# Altium project AW_SHIELD.PrjPcb
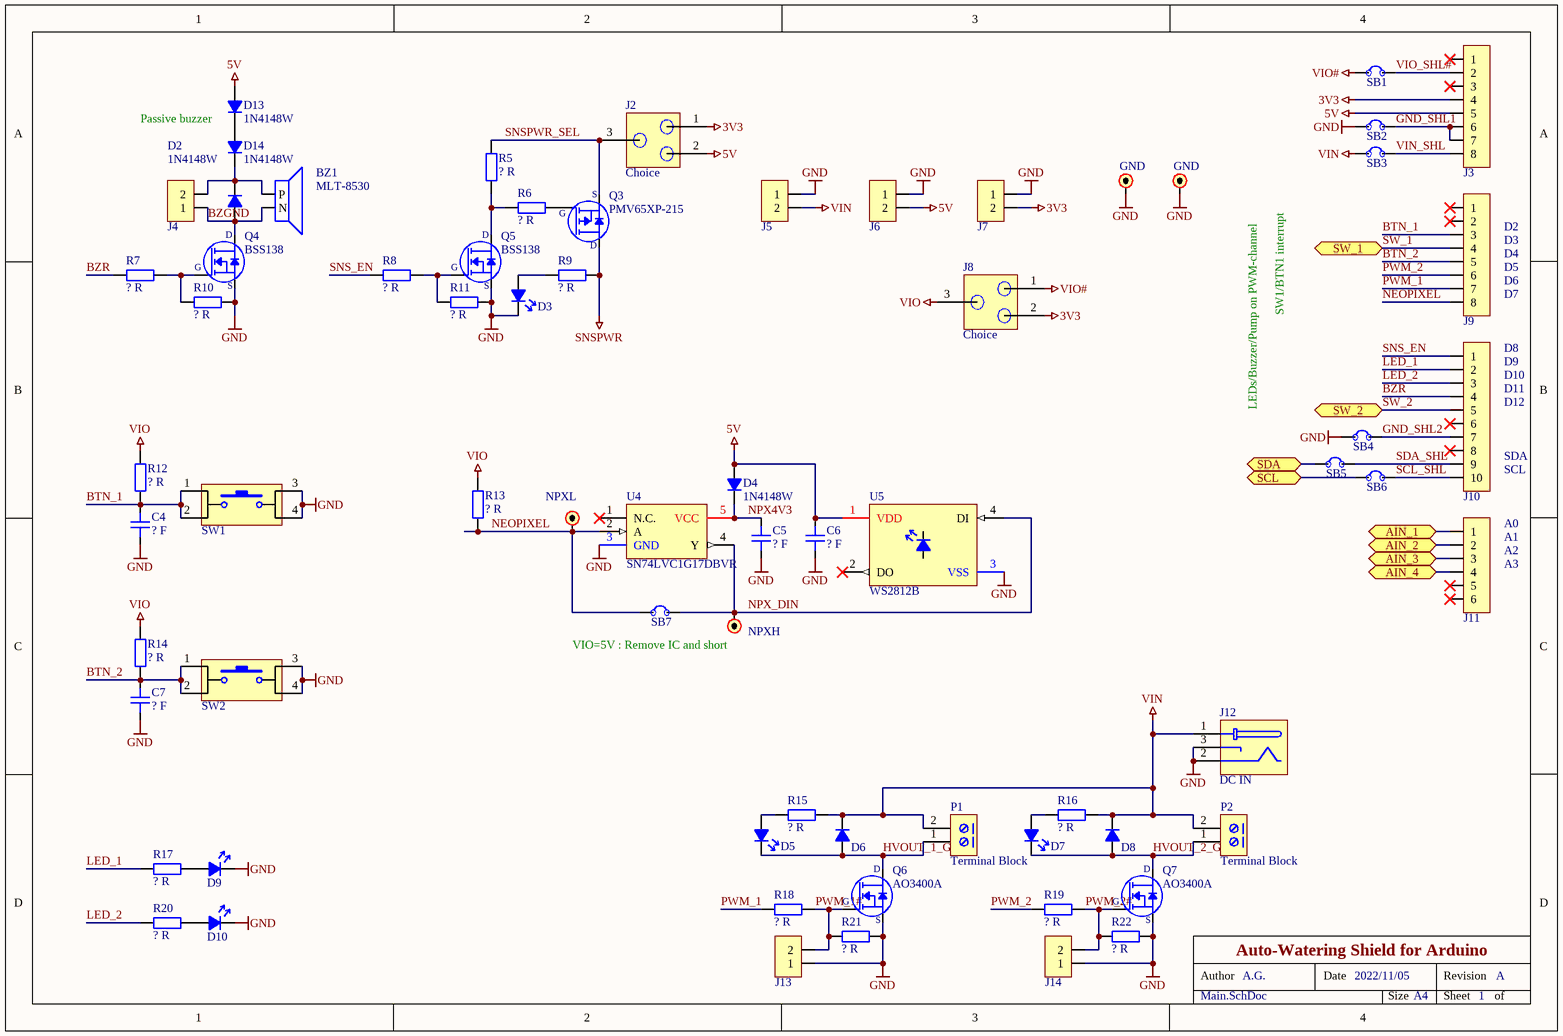
[diagram p0: Main.SchDoc]
Date: 2022/11/05; DrawnBy: A.G.; Revision: A; Title: Auto-Watering Shield for Arduino
3 sheets, 125 parts. Net scope: flat (ports and power ports of the same name join across sheets).
Board file: AW_SHIELD.PcbDoc
Sheets:
  Main.SchDoc
  I2C.SchDoc
  Inputs.SchDoc

## Sheet Main.SchDoc: Auto-Watering Shield for Arduino
size A4; Date: 2022/11/05; DrawnBy: A.G.; DocumentNumber: 1; Revision: A; SheetNumber: 1; ProjectName: AW_SHIELD.PrjPcb

### Parts
BZ1  MLT-8530  [MLT-8530]
C4  ? F  [0603C_RF_M]
C5  ? F  [0603C_RF_M]
C6  ? F  [0603C_RF_M]
C7  ? F  [0603C_RF_M]
D2  1N4148W  [D_SOD-123]
D3  Unspecified  [0805LED_RF_M]  (value not drawn)
D4  1N4148W  [D_SOD-123]
D5  Unspecified  [0805LED_RF_M]  (value not drawn)
D6  D  [ONSEMI_DO214AC_RF_M]  (value not drawn)
D7  Unspecified  [0805LED_RF_M]  (value not drawn)
D8  D  [ONSEMI_DO214AC_RF_M]  (value not drawn)
D9  Unspecified  [0805LED_RF_M]  (value not drawn)
D10  Unspecified  [0805LED_RF_M]  (value not drawn)
D13  1N4148W  [D_SOD-123]
D14  1N4148W  [D_SOD-123]
J2  Choice  [CHOICE_R0805_TR]
J3  PINHDR-8P1  [PINHDR-8P1-2.54]  (value not drawn)
J4  PINHDR-2P1  [HEADER-2.54-2P1]  (value not drawn)
J5  PINHDR-2P1  [HEADER-2.54-2P1]  (value not drawn)
J6  PINHDR-2P1  [HEADER-2.54-2P1]  (value not drawn)
J7  PINHDR-2P1  [HEADER-2.54-2P1]  (value not drawn)
J8  Choice  [CHOICE_R0805_TR]
J9  PINHDR-8P1  [PINHDR-8P1-2.54]  (value not drawn)
J10  PINHDR-10P1  [HEADER-2.54-10P1]  (value not drawn)
J11  PINHDR-6P1  [HEADER-2.54-6P1]  (value not drawn)
J12  DC IN  [CON JACK PWR 2.5mm PJ-002BH - duplicate]
J13  PINHDR-2P1  [HEADER-2.54-2P1]  (value not drawn)
J14  PINHDR-2P1  [HEADER-2.54-2P1]  (value not drawn)
P1  Terminal Block  [KF128-2P]
P2  Terminal Block  [KF128-2P]
Q3  PMV65XP-215  [IRLML_SOT-23]
Q4  BSS138  [IRLML_SOT-23]
Q5  BSS138  [IRLML_SOT-23]
Q6  AO3400A  [IRLML_SOT-23]
Q7  AO3400A  [IRLML_SOT-23]
R5  ? R  [R0603_RF_M]
R6  ? R  [R0603_RF_M]
R7  ? R  [R0603_RF_M]
R8  ? R  [R0603_RF_M]
R9  ? R  [R0603_RF_M]
R10  ? R  [R0603_RF_M]
R11  ? R  [R0603_RF_M]
R12  ? R  [R0603_RF_M]
R13  ? R  [R0603_RF_M]
R14  ? R  [R0603_RF_M]
R15  ? R  [R0603_RF_M]
R16  ? R  [R0603_RF_M]
R17  ? R  [R0603_RF_M]
R18  ? R  [R0603_RF_M]
R19  ? R  [R0603_RF_M]
R20  ? R  [R0603_RF_M]
R21  ? R  [R0603_RF_M]
R22  ? R  [R0603_RF_M]
SB1  Solder Bridge  [SLDR_BRDG_0603_OPEN]  (value not drawn)
SB2  Solder Bridge  [SLDR_BRDG_0603_OPEN]  (value not drawn)
SB3  Solder Bridge  [SLDR_BRDG_0603_OPEN]  (value not drawn)
SB4  Solder Bridge  [SLDR_BRDG_0603_OPEN]  (value not drawn)
SB5  Solder Bridge  [SLDR_BRDG_0603_OPEN]  (value not drawn)
SB6  Solder Bridge  [SLDR_BRDG_0603_OPEN]  (value not drawn)
SB7  Solder Bridge  [SLDR_BRDG_0603_OPEN]  (value not drawn)
SW1  BTN-SPST-NO-4C  [SW_TL3305AF160QG]  (value not drawn)
SW2  BTN-SPST-NO-4C  [SW_TL3305AF160QG]  (value not drawn)
TP5  GND  [PAD_R_1.5MM]
TP6  GND  [PAD_R_1.5MM]
TP7  NPXL  [PAD_R_1MM]
TP8  NPXH  [PAD_R_1MM]
U4  SN74LVC1G17DBVR  [TI_SOT-23-5]
U5  WS2812B  [WS2812B]

### Ports
AIN_1, AIN_2, AIN_3, AIN_4, SCL, SDA, SW_1, SW_2

### Nets
3V3: J2.1 J3.4 J7.2 J8.2
5V: C6.1 D4.A D13.A J2.2 J3.5 J6.2 U5.1(VDD)
GND: C4.1 C5.2 C6.2 C7.1 D3.C D9.C D10.C J5.1 J6.1 J7.1 J12.2 J12.3 J13.1 J14.1 Q4.2(S) Q5.2(S) Q6.2(S) Q7.2(S) R10.1 R11.1 R21.1 R22.1 SB2.1 SB4.1 SW1.3 SW1.4 SW2.3 SW2.4 TP5.1 TP6.1 U4.3(GND) U5.3(VSS)
SNSPWR: Q3.3(Drain) R9.2
VIN: D6.C D8.C J5.2 J12.1 P1.2 P2.2 R15.2 R16.2 SB3.1
VIO: J8.3 R12.2 R13.1 R14.2
VIO#: J8.1 SB1.1
AIN_1: J11.1 ; port AIN_1
AIN_2: J11.2 ; port AIN_2
AIN_3: J11.3 ; port AIN_3
AIN_4: J11.4 ; port AIN_4
BTN_1: C4.2 J9.3 R12.1 SW1.1 SW1.2
BTN_2: C7.2 J9.5 R14.1 SW2.1 SW2.2
BZGND: BZ1.N D2.A J4.1 Q4.3(D)
BZR: J10.4 R7.1
GND_SHL1: J3.6 J3.7 SB2.2
GND_SHL2: J10.7 SB4.2
HVOUT_1_GND: D5.C D6.A P1.1 Q6.3(D)
HVOUT_2_GND: D7.C D8.A P2.1 Q7.3(D)
LED_1: J10.2 R17.1
LED_2: J10.3 R20.1
NEOPIXEL: J9.8 R13.2 SB7.1 TP7.1 U4.2(A)
NPX4V3: C5.1 D4.C U4.5(VCC)
NPX_DIN: SB7.2 TP8.1 U4.4(Y) U5.4(DI)
PWM_1: J9.7 R18.1
PWM_1#: J13.2 Q6.1(G) R18.2 R21.2
PWM_2: J9.6 R19.1
PWM_2#: J14.2 Q7.1(G) R19.2 R22.2
SCL: SB6.1 ; port SCL
SCL_SHL: J10.10 SB6.2
SDA: SB5.1 ; port SDA
SDA_SHL: J10.9 SB5.2
SNS_EN: J10.1 R8.1
SNSPWR_SEL: J2.3 Q3.2(Source) R5.1
SW_1: J9.4 ; port SW_1
SW_2: J10.5 ; port SW_2
VIN_SHL: J3.8 SB3.2
VIO_SHL#: J3.2 SB1.2
NetBZ1_P: BZ1.P D2.C D14.C J4.2
NetD3_A: D3.A R9.1
NetD5_A: D5.A R15.1
NetD7_A: D7.A R16.1
NetD9_A: D9.A R17.2
NetD10_A: D10.A R20.2
NetD13_C: D13.C D14.A
NetQ3_1: Q3.1(Gate) R6.2
NetQ4_1: Q4.1(G) R7.2 R10.2
NetQ5_1: Q5.1(G) R8.2 R11.2
NetQ5_3: Q5.3(D) R5.2 R6.1

Not connected (* = marked no-connect by the designer): J3 1* 3*; J9 1* 2*; J10 6* 8*; J11 5* 6*; U4 1(N.C.)*; U5 2(DO)*

### Notes on the sheet
- Passive buzzer
- (near J9) D2
- (near J9) D3
- SW1/BTN1 interrupt
- (near J9) D4
- (near J9) D5
- (near J9) D6
- (near J9) D7
- D8
- (near J10) D9
- (near J10) D10
- LEDs/Buzzer/Pump on PWM-channel
- (near J10) D11
- (near J10) D12
- (near J10) SDA
- (near J10) SCL
- A0
- (near J11) A1
- (near J11) A2
- (near J11) A3
- (near TP8) VIO=5V : Remove IC and short
- Author
- Date
- Revision
- Size
- A4
- Sheet
- of
- (in symbol PMV65XP-215) S; G; D

### Library data of the parts
BZ1 = MLT-8530: Magnetic Buzzer SMD 8.5x3.3 Passive 2.5V~4.5V; Manufacturer: Jiangsu Huaneng Elec; Rated Voltage: 3.6 V; Resonant Frequency: 2700 Hz; Supplier Link: https://www.lcsc.com/mobile/product-detail/Buzzers_Jiangsu-Huaneng-Elec-MLT-8530_C94599.html; Supplier: LCSC; Alternative Supplier Link: https://www.aliexpress.ru/item/1005003620291811.html; Mounting Technology: SMT; Category: Buzzer
C4-C7 = C: Capacitor; Manufacturer: Generic Brand; Max Voltage: ? V; Value: ? F; Tolerance: ?; Mounting Technology: SMT; Tag: *; Manufacturer Part No: *; Supplier: *; Supplier Link: http://; Supplier Part No: *; Category: Capacitor
D2 D4 D13 D14 = 1N4148W: DIODE GEN PURP 100V 300MA SOD123; Similar Part: BAV16W; Manufacturer: Diodes Incorporated; Manufacturer Product Number: 1N4148W-7-F; Supplier Part No: 1N4148W-FDICT-ND; Supplier URL: https://www.digikey.com/en/products/detail/diodes-incorporated/1N4148W-7-F/814371; Mounting Technology: SMT; Package: SOD-123
D3 D5 D7 D9 D10 = LED: Manufacturer: Generic Brand; Forward Voltage Drop: ? V; Emitting Color: Unspecified; Manufacturer Part No: *; Supplier: *; Supplier Link: http://; Supplier Part No: *; Category: Diode; Mounting Technology: SMT
D6 D8 = D: Diode (Rectifier); Manufacturer: Generic Brand; Max Forward Voltage: ? V; Power Rating: ? W; Manufacturer Part No: *; Supplier: *; Supplier Link: http://; Supplier Part No: *; Mounting Technology: SMT; Category: Diode
J3 J9 = PINHDR-8P1: Pin Header Single Row 8 Positions; Mounting Technology: THT
J4-J7 J13 J14 = PINHDR-2P1: Pin Header Single Row 2 Positions; Mounting Technology: THT
J10 = PINHDR-10P1: Generic Pin Header 10x1
J11 = PINHDR-6P1: Pin Header Single Row 6 Positions; Mounting Technology: THT
J12 = PJ-002BH: CONN PWR JACK 2.5X5.5MM SOLDER; Manufacturer: CUI Devices; PartNo: CP-002BH-ND; Supplier: DigiKey; ProductNumber: PJ-002BH; URL: https://www.digikey.com/en/products/detail/cui-devices/PJ-002BH/408447; UnitPrice: $0.74; MountType: THT
P1 P2 = TERM-BLOCK-2C
Q3 = PMV65XP-215: MOSFET P-CH 20V 2.8A 23SOT; Gate-Source Threshold Voltage: -0.69V (typ.); Drain-Source Breakdown Voltage: -20V; Drain Current: -2.8A (max.); Max Gate-Source Voltage: 12V (abs.); Supplier Part No: 1727-3124-1-ND; Supplier: DigiKey; Supplier Link: https://www.digikey.com/en/products/detail/nexperia-usa-inc/PMV65XP-215/949643; Mounting Technology: SMT; Package: SOT-23; Alternative Supplier: Chipdip; Alternative Supplier Link: https://www.chipdip.by/product/pmv65xp.215; Alternative Supplier Part No: 9000037397
Q4 Q5 = BSS138: MOSFET N-CH 50V 200MA SOT23; Manufacturer: ON Semiconductor; Manufacturer Part No: BSS138LT1G; Supplier: DigiKey; Supplier Link: https://www.digikey.com/en/products/detail/on-semiconductor/BSS138L/5044751; Supplier Part No: BSS138LCT-ND; Mounting Technology: SMT; Package: SOT-23; Alternative Supplier: Chipdip; Alternative Supplier Part No: 457167271; Alternative Supplier Link: https://www.chipdip.by/product/bss138-onsemi
Q6 Q7 = AO3400A: MOSFET N-CH 30V 5.7A SOT23-3L; Manufacturer: Alpha & Omega; Manufacturer Part No: AO3400A; Supplier: AliExpress; Supplier Link: https://aliexpress.ru/item/1626916488.html; Supplier Part No: 1626916488; Mounting Technology: SMT; Package: SOT-23-3L
R5-R22 = R: Resistor; Manufacturer: Generic Brand; Power Rating: ? W; Max Voltage: ? V; Value: ? R; Tolerance: ?; Supplier Link: http://; Category: Resistor; Mounting Technology: SMT
SW1 SW2 = BTN-SPST-NO-4C: Tactile Switch SPST-NO; Manufacturer: Generic Brand; Category: Tactile Button; Mounting Technology: THT; Supplier Link: http://
TP5-TP8 = Test Point: Test Point / Pad
U4 = SN74LVC1G17DBVR: IC BUF NON-INVERT 5.5V SOT23-5; Manufacturer: Texas Instruments; Supplier Part No: 296-11933-1-ND; Supplier URL: https://www.digikey.com/en/products/detail/texas-instruments/SN74LVC1G17DBVR/389051; Supplier Unit Price: $0.29; Supplier Packaging: Cut Tape; Manufacturer Product Number: SN74LVC1G17DBVR; Operating Temperature: -40°C ~ 125°C (TA); Mounting Type: SMT; Package: SOT-23-5
U5 = WS2812B: ADDRESS LED DISCRETE SERIAL RGB; Manufacturer: Worldsemi

## Sheet I2C.SchDoc: Auto-Watering Shield for Arduino
size A4; Date: 2022/11/05; DrawnBy: A.G.; DocumentNumber: 1; Revision: A; SheetNumber: 1; ProjectName: AW_SHIELD.PrjPcb
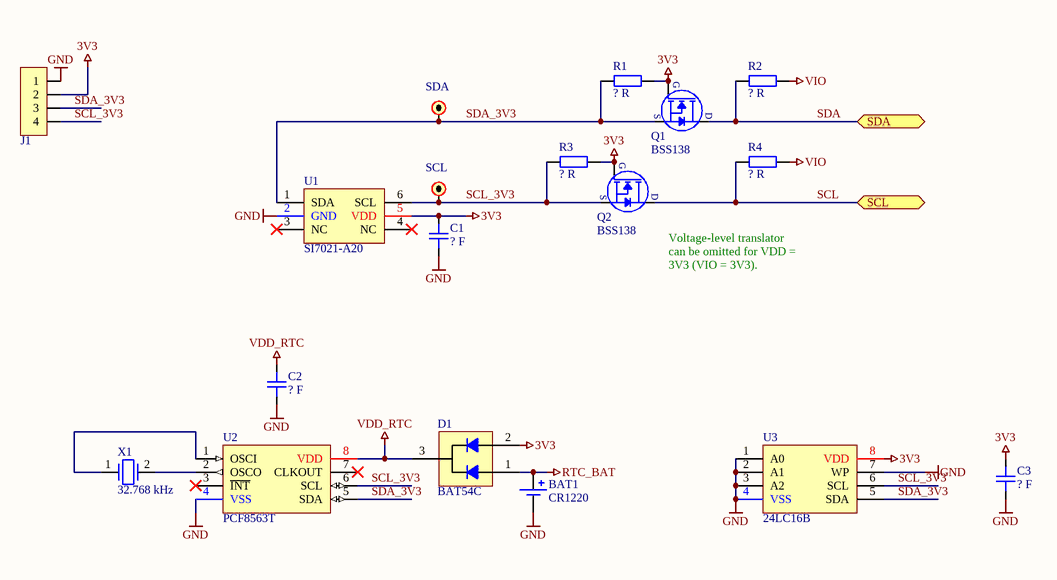
[diagram p1: I2C.SchDoc]

### Parts
BAT1  CR1220  [BC501SM]
C1  ? F  [0603C_RF_M]
C2  ? F  [0603C_RF_M]
C3  ? F  [0603C_RF_M]
D1  BAT54C  [IRLML_SOT-23]
J1  PINHDR-4P1  [HEADER-2.54-4P1]  (value not drawn)
Q1  BSS138  [IRLML_SOT-23]
Q2  BSS138  [IRLML_SOT-23]
R1  ? R  [R0603_RF_M]
R2  ? R  [R0603_RF_M]
R3  ? R  [R0603_RF_M]
R4  ? R  [R0603_RF_M]
TP1  SDA  [PAD_R_1MM]
TP2  SCL  [PAD_R_1MM]
U1  SI7021-A20  [SI7021_DFN-6_RF_M]
U2  PCF8563T  [SOIC-8]
U3  24LC16B  [SOIC-8]
X1  32.768 kHz  [XTAL_3215]

### Ports
SCL, SDA

### Nets
3V3: C1.2 C3.2 D1.2(A2) J1.2 Q1.1(G) Q2.1(G) R1.1 R3.1 U1.5(VDD) U3.8(VDD)
GND: BAT1.N C1.1 C2.1 C3.1 J1.1 U1.2(GND) U2.4(VSS) U3.1(A0) U3.2(A1) U3.3(A2) U3.4(VSS) U3.7(WP)
RTC_BAT: BAT1.P D1.1(A1)
VDD_RTC: C2.2 D1.3(C) U2.8(VDD)
VIO: R2.2 R4.1
SCL: Q2.3(D) R4.2 ; port SCL
SCL_3V3: J1.4 Q2.2(S) R3.2 TP2.1 U1.6(SCL) U2.6(SCL) U3.6(SCL)
SDA: Q1.3(D) R2.1 ; port SDA
SDA_3V3: J1.3 Q1.2(S) R1.2 TP1.1 U1.1(SDA) U2.5(SDA) U3.5(SDA)
NetU2_1: U2.1(OSCI) X1.1
NetU2_2: U2.2(OSCO) X1.2

Not connected (* = marked no-connect by the designer): U1 3(NC)* 4(NC)*; U2 3(~{INT})* 7(CLKOUT)*

### Notes on the sheet
- (near Q2) Voltage-level translator can be omitted for VDD = 3V3 (VIO = 3V3).
- Author
- Date
- Revision
- Size
- A4
- Sheet
- of

### Library data of the parts
BAT1 = BC501SM: Single Cell Battery; Nominal Voltage: 3V; Supplier: DigiKey; Supplier Part No: BC501SM-ND; Supplier Link: https://www.digikey.com/en/products/detail/mpd-memory-protection-devices/BC501SM/2439260; Mounting Technology: SMT; Suitable Battery: CR1220
C1-C3 = C: as C4 on sheet Main; Value: ? F; Tolerance: ?; Mounting Technology: SMT; Tag: *; Manufacturer Part No: *; Supplier: *; Supplier Link: http://; Supplier Part No: *; Category: Capacitor
D1 = BAT54C: DIODE ARRAY SCHOTTKY COMM CATH 30V 0.2A SOT-23; PartNo: BAT54C-FDICT-ND; Manufacturer: Diodes Incorporated; DiodeConfiguration: 1 Pair Common Cathode; ProductNumber: BAT54C-7-F; BaseProduct: BAT54C; Supplier: DigiKey; URL: https://www.digikey.com/en/products/detail/diodes-incorporated/BAT54C-7-F/717701; MountingTechnology: SMT; UnitPrice: $0.18; Package: SOT-23-3
J1 = PINHDR-4P1: Generic Pin Header 4x1
Q1 Q2 = BSS138: as Q4 on sheet Main; Supplier: DigiKey; Supplier Link: https://www.digikey.com/en/products/detail/on-semiconductor/BSS138L/5044751; Supplier Part No: BSS138LCT-ND; Mounting Technology: SMT; Package: SOT-23; Alternative Supplier: Chipdip; Alternative Supplier Part No: 457167271; Alternative Supplier Link: https://www.chipdip.by/product/bss138-onsemi
R1-R4 = R: as R5 on sheet Main; Value: ? R; Tolerance: ?; Supplier Link: http://; Category: Resistor; Mounting Technology: SMT
TP1 TP2 = Test Point: Test Point / Pad
U1 = SI7021-A20: SENS HUMID/TEMP 3.6V I2C 2% 6DFN; Manufacturer Product Number: SI7021-A20-GM1R; Manufacturer: Silicon Labs; Supplier URL: https://www.digikey.com/en/products/detail/silicon-labs/SI7021-A20-GM1/5048934; Supplier Part No: 336-4380-1-ND; Supplier Package: Cut Tape (CT); Mounting Type: SMT; Package: DFN-6
X1 = KX-327NHT: Crystal Resonator (2 Leads); Manufacturer: Geyer; Load Capacitance: 12.5 pF; Tolerance: 20 ppm; Manufacturer Part No: KX-327NHT; Mounting Technology: SMT; Alternative Supplier: Belchip; Alternative Supplier Link: https://belchip.by/product/?selected_product=33387; Alternative Supplier Part No: 33387; Category: Crystal; Value: 32.768 kHz

## Sheet Inputs.SchDoc: Auto-Watering Shield for Arduino
size A4; Date: 2022/11/05; DrawnBy: A.G.; DocumentNumber: 1; Revision: A; SheetNumber: 1; ProjectName: AW_SHIELD.PrjPcb
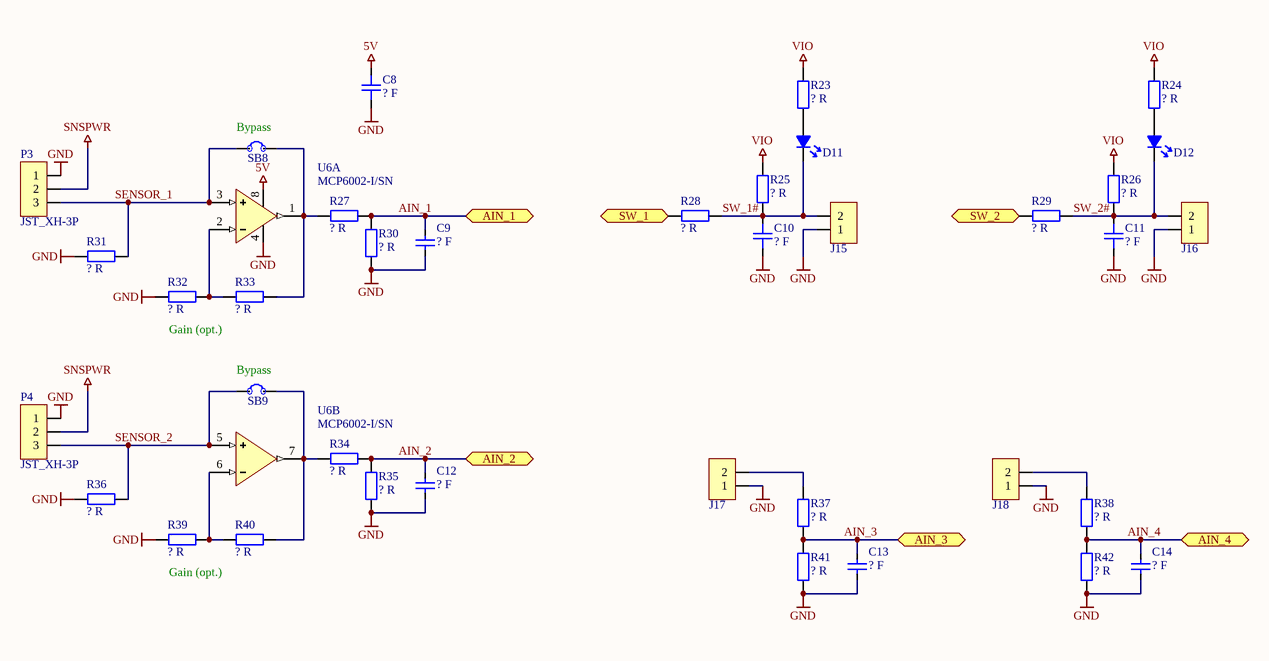
[diagram p2: Inputs.SchDoc]

### Parts
C8  ? F  [0603C_RF_M]
C9  ? F  [0603C_RF_M]
C10  ? F  [0603C_RF_M]
C11  ? F  [0603C_RF_M]
C12  ? F  [0603C_RF_M]
C13  ? F  [0603C_RF_M]
C14  ? F  [0603C_RF_M]
D11  Unspecified  [0805LED_RF_M]  (value not drawn)
D12  Unspecified  [0805LED_RF_M]  (value not drawn)
J15  PINHDR-2P1  [HEADER-2.54-2P1]  (value not drawn)
J16  PINHDR-2P1  [HEADER-2.54-2P1]  (value not drawn)
J17  PINHDR-2P1  [HEADER-2.54-2P1]  (value not drawn)
J18  PINHDR-2P1  [HEADER-2.54-2P1]  (value not drawn)
P3  JST_XH-3P  [JST_B3B-XH-A_LF_SN]
P4  JST_XH-3P  [JST_B3B-XH-A_LF_SN]
R23  ? R  [R0603_RF_M]
R24  ? R  [R0603_RF_M]
R25  ? R  [R0603_RF_M]
R26  ? R  [R0603_RF_M]
R27  ? R  [R0603_RF_M]
R28  ? R  [R0603_RF_M]
R29  ? R  [R0603_RF_M]
R30  ? R  [R0603_RF_M]
R31  ? R  [R0603_RF_M]
R32  ? R  [R0603_RF_M]
R33  ? R  [R0603_RF_M]
R34  ? R  [R0603_RF_M]
R35  ? R  [R0603_RF_M]
R36  ? R  [R0603_RF_M]
R37  ? R  [R0603_RF_M]
R38  ? R  [R0603_RF_M]
R39  ? R  [R0603_RF_M]
R40  ? R  [R0603_RF_M]
R41  ? R  [R0603_RF_M]
R42  ? R  [R0603_RF_M]
SB8  Solder Bridge  [SLDR_BRDG_0603_OPEN]  (value not drawn)
SB9  Solder Bridge  [SLDR_BRDG_0603_OPEN]  (value not drawn)
U6  MCP6002-I/SN  [SOIC-8]  (parts A,B of 2)

### Ports
AIN_1, AIN_2, AIN_3, AIN_4, SW_1, SW_2

### Nets
5V: C8.2 U6.8
GND: C8.1 C9.1 C10.1 C11.1 C12.1 C13.1 C14.1 J15.1 J16.1 J17.1 J18.1 P3.1 P4.1 R30.1 R31.2 R32.2 R35.2 R36.2 R39.2 R41.1 R42.1 U6.4
SNSPWR: P3.2 P4.2
VIO: R23.1 R24.1 R25.2 R26.2
AIN_1: C9.2 R27.2 R30.2 ; port AIN_1
AIN_2: C12.2 R34.1 R35.1 ; port AIN_2
AIN_3: C13.2 R37.1 R41.2 ; port AIN_3
AIN_4: C14.2 R38.1 R42.2 ; port AIN_4
SENSOR_1: P3.3 R31.1 SB8.1 U6.3
SENSOR_2: P4.3 R36.1 SB9.1 U6.5
SW_1: R28.2 ; port SW_1
SW_1#: C10.2 D11.C J15.2 R25.1 R28.1
SW_2: R29.2 ; port SW_2
SW_2#: C11.2 D12.C J16.2 R26.1 R29.1
NetD11_A: D11.A R23.2
NetD12_A: D12.A R24.2
NetJ17_2: J17.2 R37.2
NetJ18_2: J18.2 R38.2
NetR27_1: R27.1 R33.1 SB8.2 U6.1
NetR32_1: R32.1 R33.2 U6.2
NetR34_2: R34.2 R40.1 SB9.2 U6.7
NetR39_1: R39.1 R40.2 U6.6

### Notes on the sheet
- (near SB8) Bypass
- Gain (opt.)
- (near SB9) Bypass
- Author
- Date
- Revision
- Size
- A4
- Sheet
- of

### Library data of the parts
C8-C14 = C: as C4 on sheet Main; Value: ? F; Tolerance: ?; Mounting Technology: SMT; Tag: *; Manufacturer Part No: *; Supplier: *; Supplier Link: http://; Supplier Part No: *; Category: Capacitor
D11 D12 = LED: as D3 on sheet Main; Emitting Color: Unspecified; Manufacturer Part No: *; Supplier: *; Supplier Link: http://; Supplier Part No: *; Category: Diode; Mounting Technology: SMT
J15-J18 = PINHDR-2P1: Pin Header Single Row 2 Positions; Mounting Technology: THT
P3 P4 = JST_XH-3P: CONN HEADER VERT 3POS 2.5MM
R23-R42 = R: as R5 on sheet Main; Value: ? R; Tolerance: ?; Supplier Link: http://; Category: Resistor; Mounting Technology: SMT
U6 = MCP6002-I/SN: IC OPAMP GP 2 CIRCUIT 8SOIC; DIGIKEY_PART_NO: MCP6002-I/SN-ND; DIGIKEY_URL: https://www.digikey.com/en/products/detail/microchip-technology/MCP6002-I-SN/500876; DIGIKEY_UNIT_PRICE: $0.33

## Nets that join several sheets
3V3: Main (J2.1 J3.4 J7.2 J8.2), I2C (10 pins)
5V: Main (7 pins), Inputs (C8.2 U6.8)
GND: Main (32 pins), I2C (12 pins), Inputs (22 pins)
SNSPWR: Main (Q3.3 R9.2), Inputs (P3.2 P4.2)
VIO: Main (J8.3 R12.2 R13.1 R14.2), I2C (R2.2 R4.1), Inputs (R23.1 R24.1 R25.2 R26.2)
AIN_1: Main (J11.1), Inputs (C9.2 R27.2 R30.2)
AIN_2: Main (J11.2), Inputs (C12.2 R34.1 R35.1)
AIN_3: Main (J11.3), Inputs (C13.2 R37.1 R41.2)
AIN_4: Main (J11.4), Inputs (C14.2 R38.1 R42.2)
SCL: Main (SB6.1), I2C (Q2.3 R4.2)
SDA: Main (SB5.1), I2C (Q1.3 R2.1)
SW_1: Main (J9.4), Inputs (R28.2)
SW_2: Main (J10.5), Inputs (R29.2)